# EAGLE design eagle 1 board (EAGLE 9.2.0)
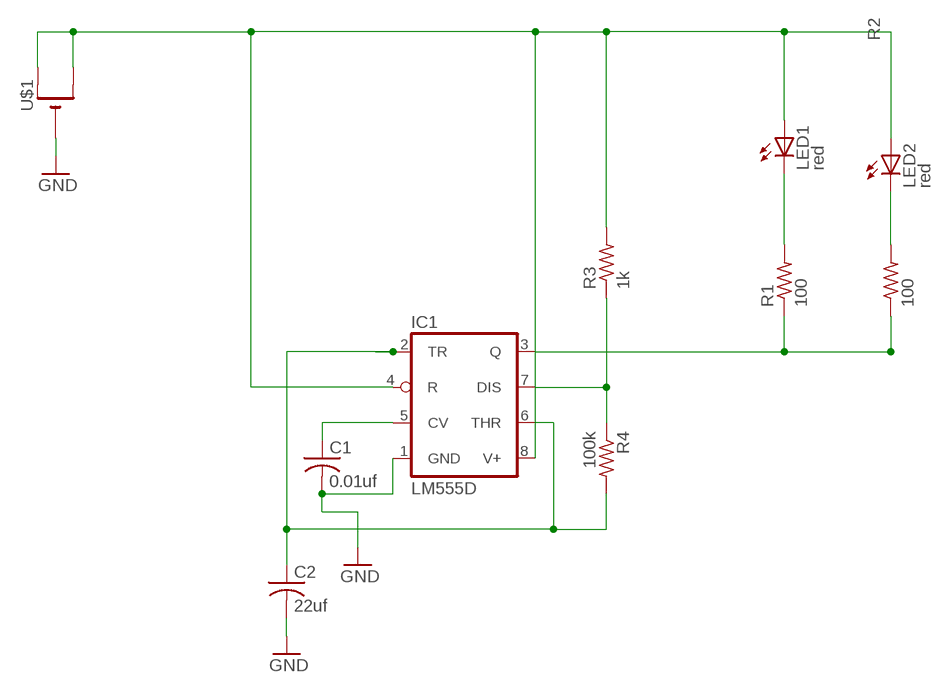
[diagram p0: schematic, sheet 1]

## Parts
C1  0.01uf  C-USC0805  [C0805]
C2  22uf  C-USC0805  [C0805]
IC1  LM555D  [SO08]
LED1  red  LEDCHIPLED_0805  [CHIPLED_0805]
LED2  red  LEDCHIPLED_0805  [CHIPLED_0805]
R1  100  R-US_R0805  [R0805]
R2  100  R-US_R0805  [R0805]
R3  1k  R-US_R0805  [R0805]
R4  100k  R-US_R0805  [R0805]
U$1  CR1220SMT  [CR1220-SMD]

## Nets
GND: C1.2 C2.2 IC1.1(GND) U$1.-
N$1: LED1.C R1.2
N$2: LED2.C R2.2
N$3: IC1.3(Q) R1.1 R2.1
N$5: IC1.7(DIS) R3.1 R4.1
N$6: C1.1 IC1.5(CV)
N$8: C2.1 IC1.2(TR) IC1.6(THR) R4.2
N$9: IC1.4(R) IC1.8(V+) LED1.A LED2.A R3.2 U$1.+$1(+) U$1.+$2(+1)

## Library data of the parts
C1 C2 = adafruit:C-US: CAPACITOR, American symbol
IC1 = adafruit:*555: TIMER Changed DIP package to have round (not oval) pin pads http://www.ladyada.net/library/pcb/eaglelibrary.html
LED1 LED2 = adafruit:LED: LED OSRAM: - CHIPLED LG R971, LG N971, LY N971, LG Q971, LY Q971, LO R971, LY R971 LH N974, LH R974 LS Q976, LO Q976, LY Q976 LO Q996 - Hyper CHIPLED LW Q18S LB Q993, LB Q99A, LB R99A - SideLED LS A670, LO A670, LY A670, LG A670, LP A670 LB A673, LV A673, LT A673, LW A673 LH A674 LY A675 LS A676, LA A676, LO A676, LY A676, LW A676 LS A679, LY A679, LG A679 - Hyper Micro SIDELED® LS Y876, LA Y876, LO Y876, LY Y876 LT Y87S - SmartLED LW L88C, LW L88S LB L89C, LB L89S, LG L890 LS L89K, LO L89K, LY L89K LS L896, LA L896, LO L896, LY L896 - TOPLED LS T670, LO T670, LY T670, LG T670, LP T670 LSG T670, LSP T670, LSY T670, LOP T670, LYG T670 LG T671, LOG T671, LSG T671 LB T673, LV T673, LT T673, LW T673 LH T674 LS T676, LA T676, LO T676, LY T676, LB T676, LH T676, LSB T676, LW T676 LB T67C, LV T67C, LT T67C, LS T67K, LO T67K, LY T67K, LW E67C LS E67B, LA E67B, LO E67B, LY E67B, LB E67C, LV E67C, LT E67C LW T67C LS T679, LY T679, LG T679 LS T770, LO T770, LY T770, LG T770, LP T770 LB T773, LV T773, LT T773, LW T773 LH T774 LS E675, LA E675, LY E675, LS T675 LS T776, LA T776, LO T776, LY T776, LB T776 LHGB T686 LT T68C, LB T68C - Hyper Mini TOPLED® LB M676 - Mini TOPLED Santana® LG M470 LS M47K, LO M47K, LY M47K Source: http://www.osram.convergy.de/
R1-R4 = adafruit:R-US_: RESISTOR, American symbol
U$1 = adafruit:CR1220: CR1216/CR1220/CR1225 12mm 3V lithium coin cell Great for battery packup. Both SMT and THM holders. Note the THM package has the ground pads on both sides of the PCB so that the masks are the same - this reduces the cost

## Net classes
0 default: width 0.305 mm, drill 0.508 mm, clearance 0.254 mm

## Board
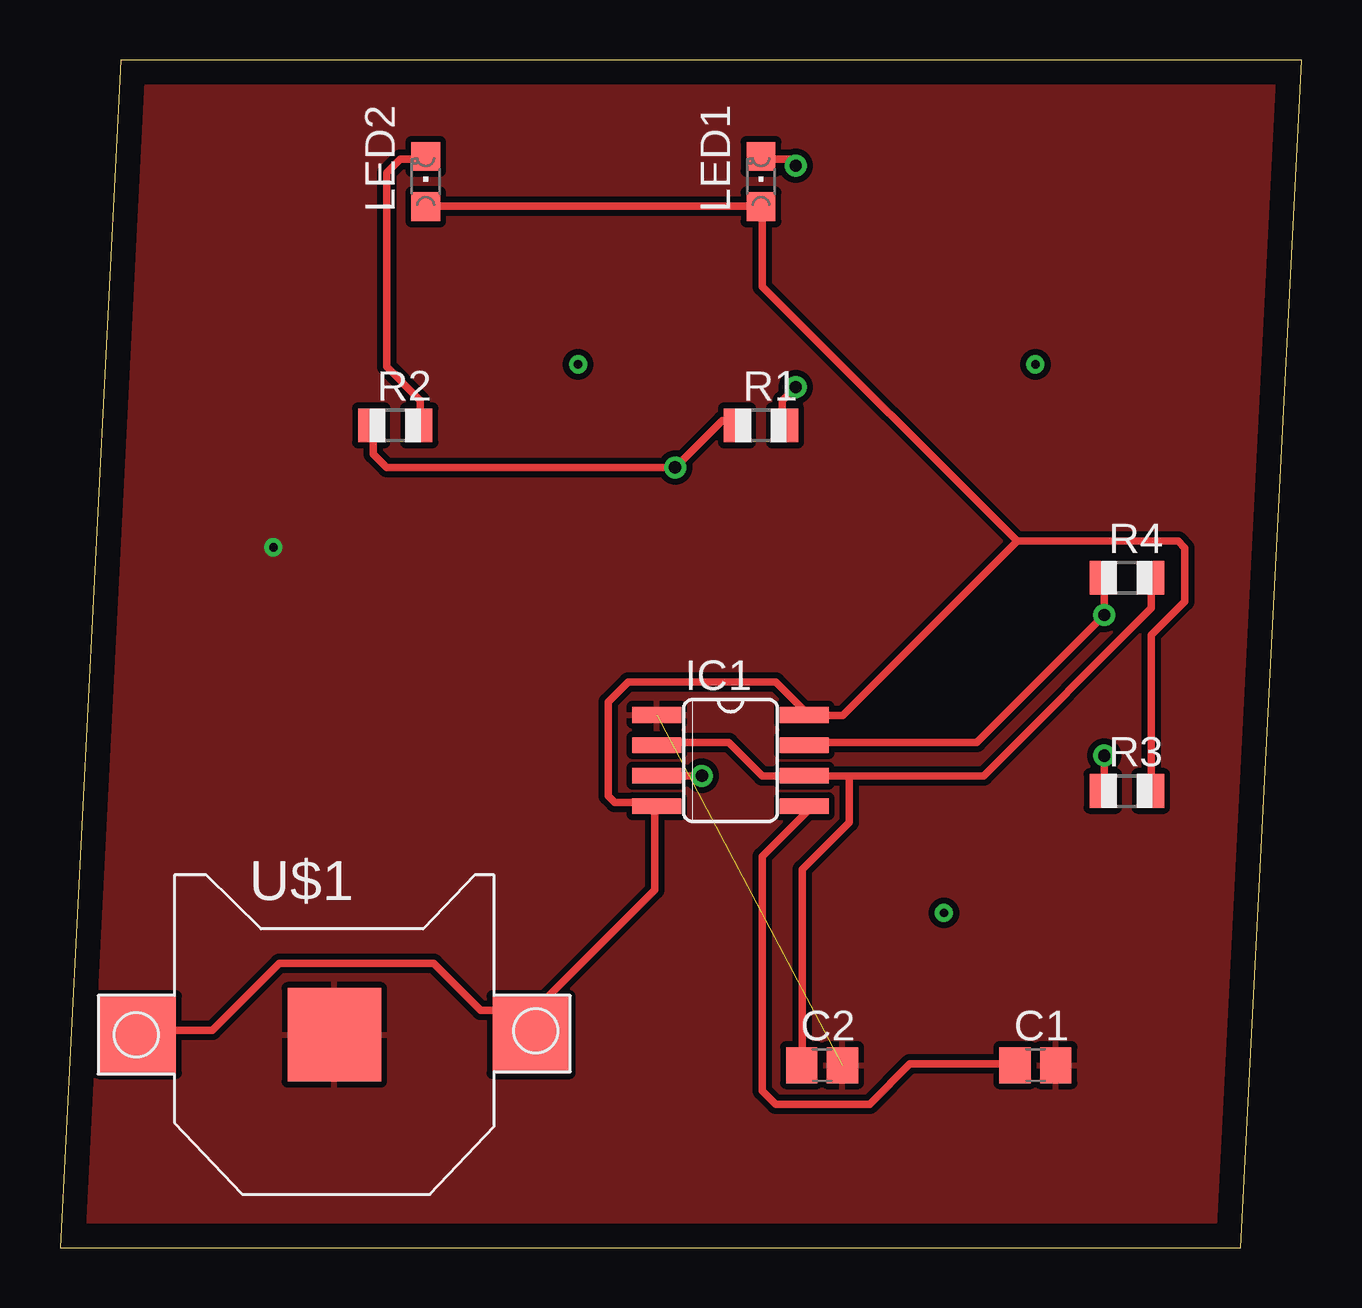
[diagram p1: board, top side]
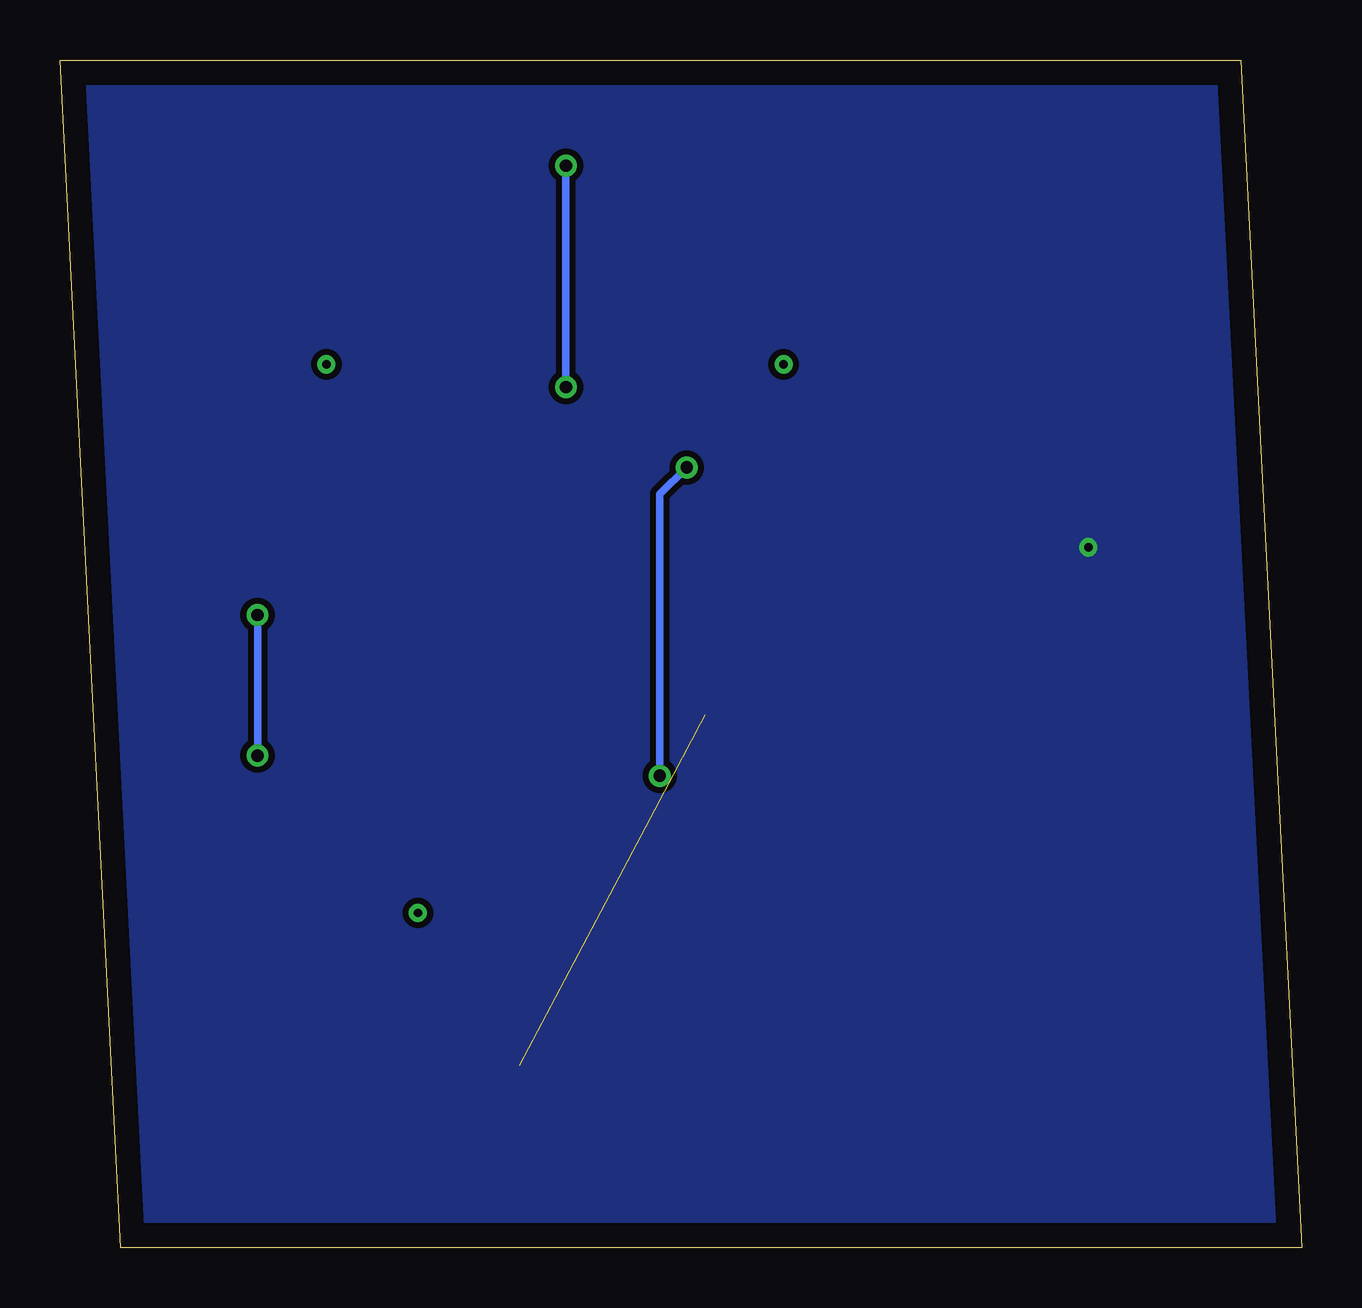
[diagram p2: board, bottom side, seen from below]

Size 51.74 x 49.52 mm. Coordinates in mm from the lower left corner, seen from the top.
Outline: 0,0 49.2,0 51.74,49.52 2.54,49.52 0,0
Copper layers (1*16): Top 0.035mm / dielectric 1.5mm / Bottom 0.035mm
Design rules "default *": minimum track width 6mil, minimum drill 20mil, track to track 6mil, track to pad 6mil, pad to pad 6mil, via to via 6mil, smd to smd 6mil, copper to edge 40mil, drill to drill 6mil, minimum pad ring 10mil, minimum via ring 8mil, stop-mask expansion 4mil, vias tented up to drill 0mil, thermal gap 10mil

### Footprints (pad centres in the part's own frame; a part is rotated, then mirrored left to right if it is on the bottom)
C0805 = smd 1.3 x 1.5: 1 -0.85,0; 2 0.85,0
SO08 = smd 0.66 x 2.032: 1 -1.905,-3.073; 2 -0.635,-3.073; 3 0.635,-3.073; 4 1.905,-3.073; 5 1.905,3.073; 6 0.635,3.073; 7 -0.635,3.073; 8 -1.905,3.073
CHIPLED_0805 = smd 1.2 x 1.2: A 0,-1.05; C 0,1.05
R0805 = smd 1.1 x 1.4: 1 -1,0; 2 1,0
CR1220-SMD = smd 3.2 x 3.2: +$1 -8.2,0; +$2 8.2,0 | smd 3.9 x 3.9: - 0,0

### Placement (x,y rotation side)
C1  40.64,7.62 0 top
C2  31.75,7.62 0 top
IC1  27.94,20.32 270 top
LED1  29.21,44.45 0 top
LED2  15.24,44.45 0 top
R1  29.21,34.29 0 top
R2  13.97,34.29 0 top
R3  44.45,19.05 0 top
R4  44.45,27.94 0 top
U$1  11.43,8.89 0 top

### Tracks (layer width: path | path; a pad name or v marks a point on that pad's centre or on a via)
GND  (via drill 0.35)  (1 unrouted)
  other vias: 8.89,29.21
  pour Top: 0,52.07 -3.81,48.26 -3.81,-1.27 53.34,-1.27 54.61,0 54.61,30.48 54.61,49.53 52.07,52.07 43.18,52.07
  pour Bottom: 1.27,48.26 -6.35,40.64 -6.35,0 -3.81,-2.54 54.61,-2.54 55.88,-1.27 55.88,48.26 53.34,50.8 1.27,50.8
N$1  (via drill 0.51)
  Top 0.305: v30.66,45.11 30.38,45.39 29.26,45.39 LED1.C | v30.66,35.89 30.1,35.33 30.1,34.49 R1.2
  Bottom 0.305: v30.66,35.89 v30.66,45.11
N$2
  Top 0.305: LED2.C 15.01,45.39 14.17,45.39 13.61,44.83 13.61,36.73 15.01,35.33 15.01,34.49 R2.2
N$3  (via drill 0.51)
  Top 0.305: R2.1 13.06,34.21 13.06,33.1 13.61,32.54 v25.63,32.54 27.58,34.49 28.14,34.49 R1.1 | v26.75,19.68 IC1.3
  Bottom 0.305: v26.75,19.68 26.75,31.42 v25.63,32.54
N$4  (via drill 0.35)
  other vias: 21.59,36.83
N$5  (via drill 0.51)
  Top 0.305: v43.51,20.52 43.51,19.13 R3.1 | R4.1 43.51,27.79 v43.51,26.39 38.2,21.08 31.22,21.08 IC1.7
  Bottom 0.305: v43.51,26.39 v43.51,20.52
N$6
  Top 0.305: C1.1 39.6,7.67 35.41,7.67 33.73,5.99 29.82,5.99 29.26,6.55 29.26,16.33 31.22,18.29 IC1.5
N$7  (via drill 0.35)
  other vias: 40.64,36.83
N$8
  Top 0.305: 32.89,19.68 IC1.6 29.26,19.68 27.86,21.08 25.07,21.08 IC1.2 | 32.89,19.68 38.48,19.68 45.47,26.67 45.47,27.79 R4.2 | 32.89,19.68 32.89,17.73 30.94,15.77 30.94,7.67 C2.1
N$9
  Top 0.305: 19.76,9.91 24.79,14.94 24.79,18.29 IC1.4 24.79,18.57 23.11,18.57 22.83,18.85 22.83,22.76 23.67,23.6 29.82,23.6 30.94,22.48 IC1.8 31.22,22.2 32.61,22.2 39.88,29.46 | 19.76,9.91 19.76,9.07 U$1.+$2 19.76,9.91 | 19.76,9.91 17.53,9.91 15.57,11.86 9.14,11.86 6.35,9.07 3.28,9.07 U$1.+$1 | LED2.A 15.29,43.43 28.98,43.43 LED1.A 29.26,43.16 29.26,40.08 39.88,29.46 | 39.88,29.46 46.58,29.46 46.86,29.18 46.86,26.95 45.47,25.55 45.47,19.13 R3.2
N$10  (via drill 0.35)
  other vias: 36.83,13.97